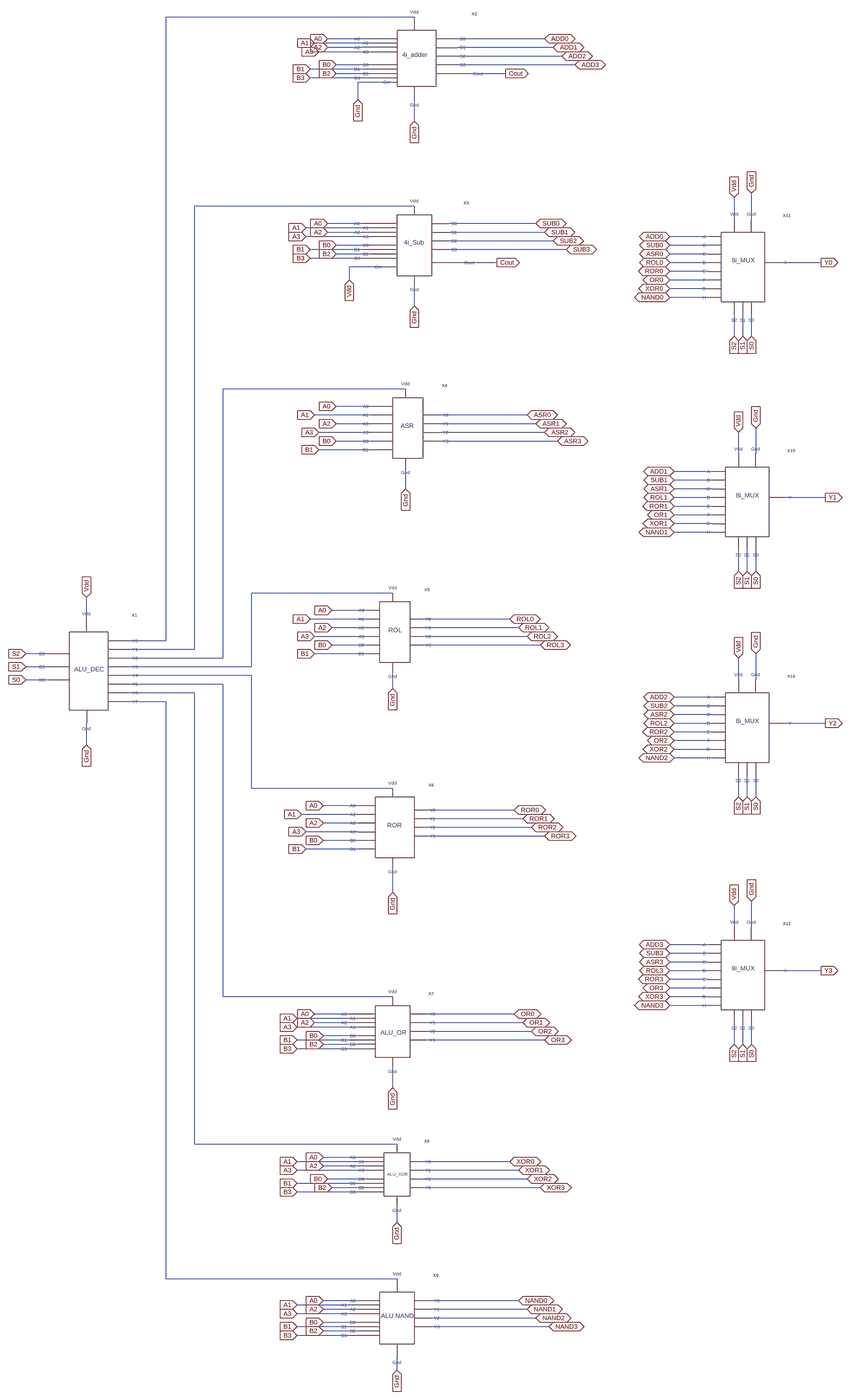
[diagram p0: schematic ALU.asc, whole sheet]
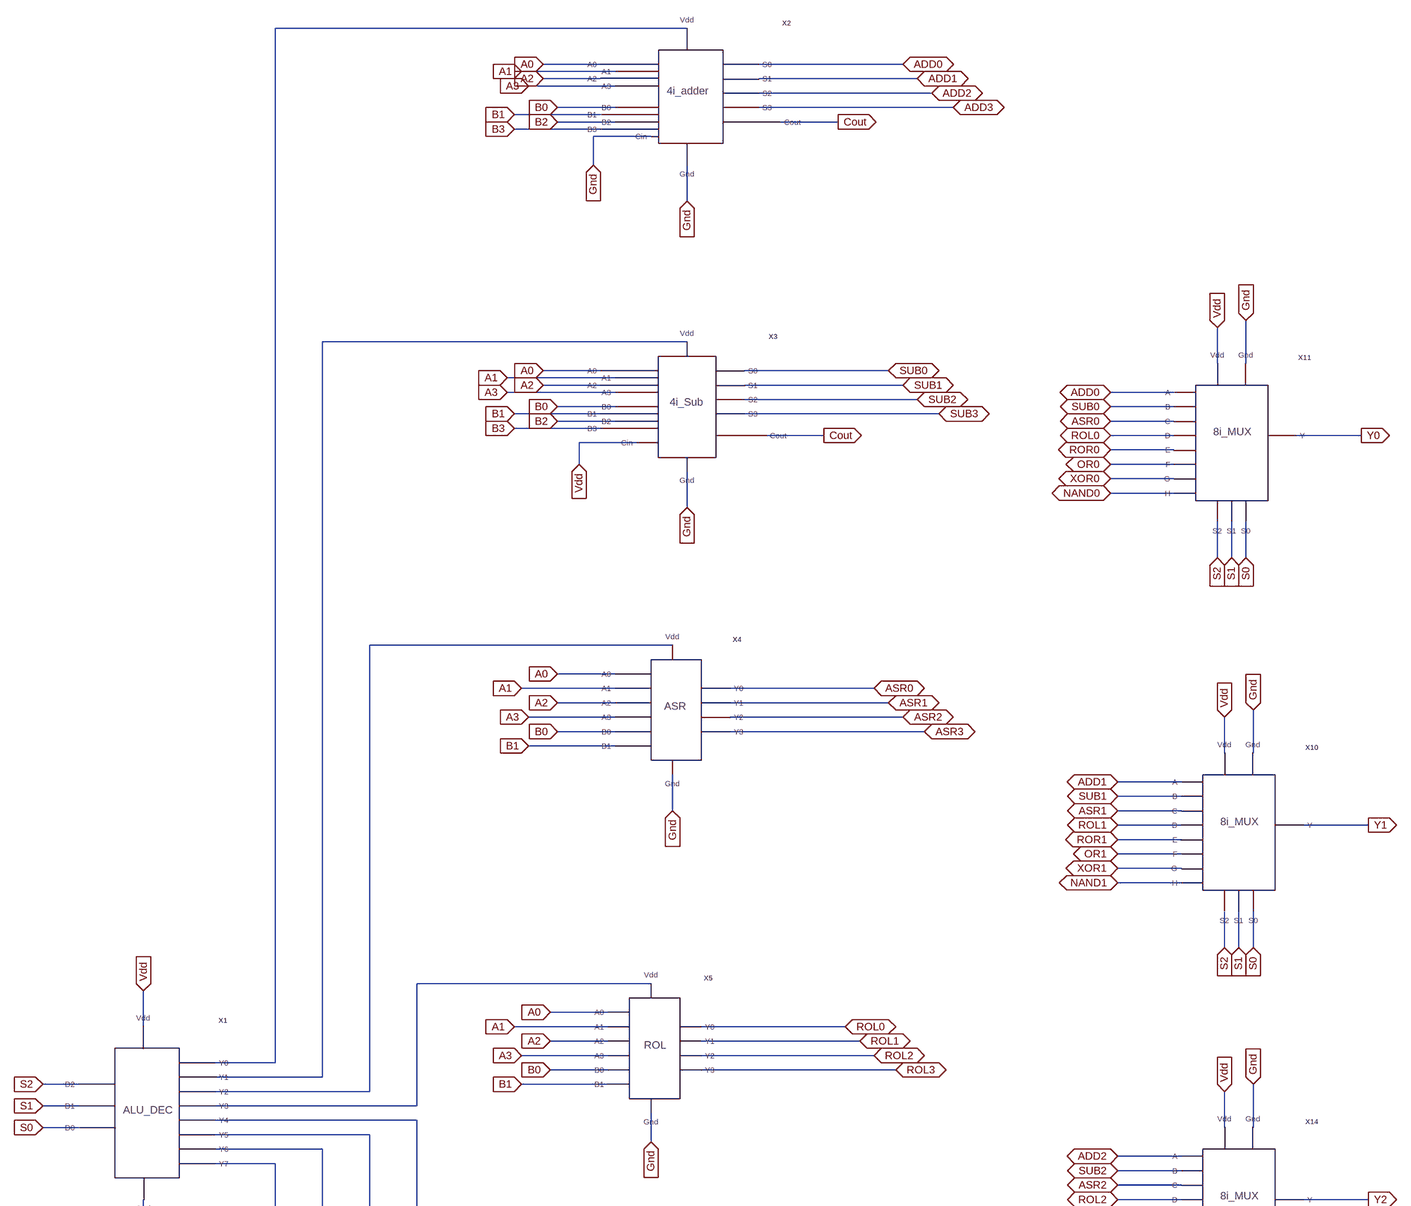
[diagram p1: schematic ALU.asc, part, row 1 of 2, column 1 of 1]
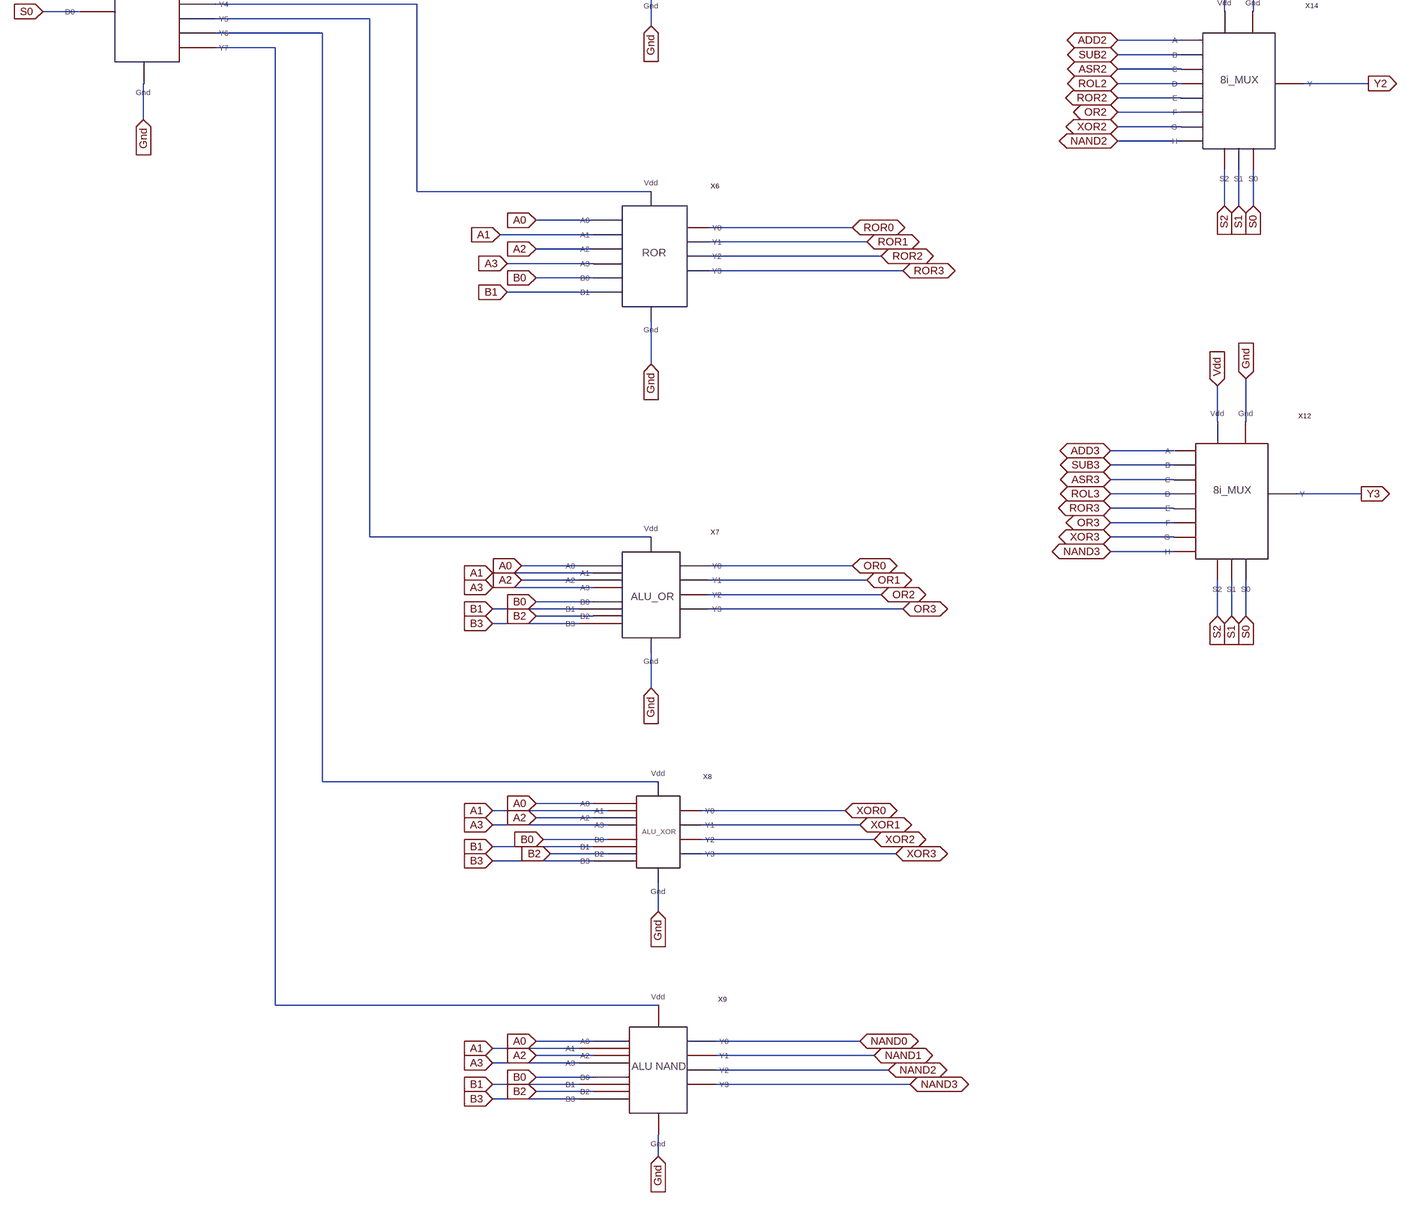
[diagram p2: schematic ALU.asc, part, row 2 of 2, column 1 of 1]
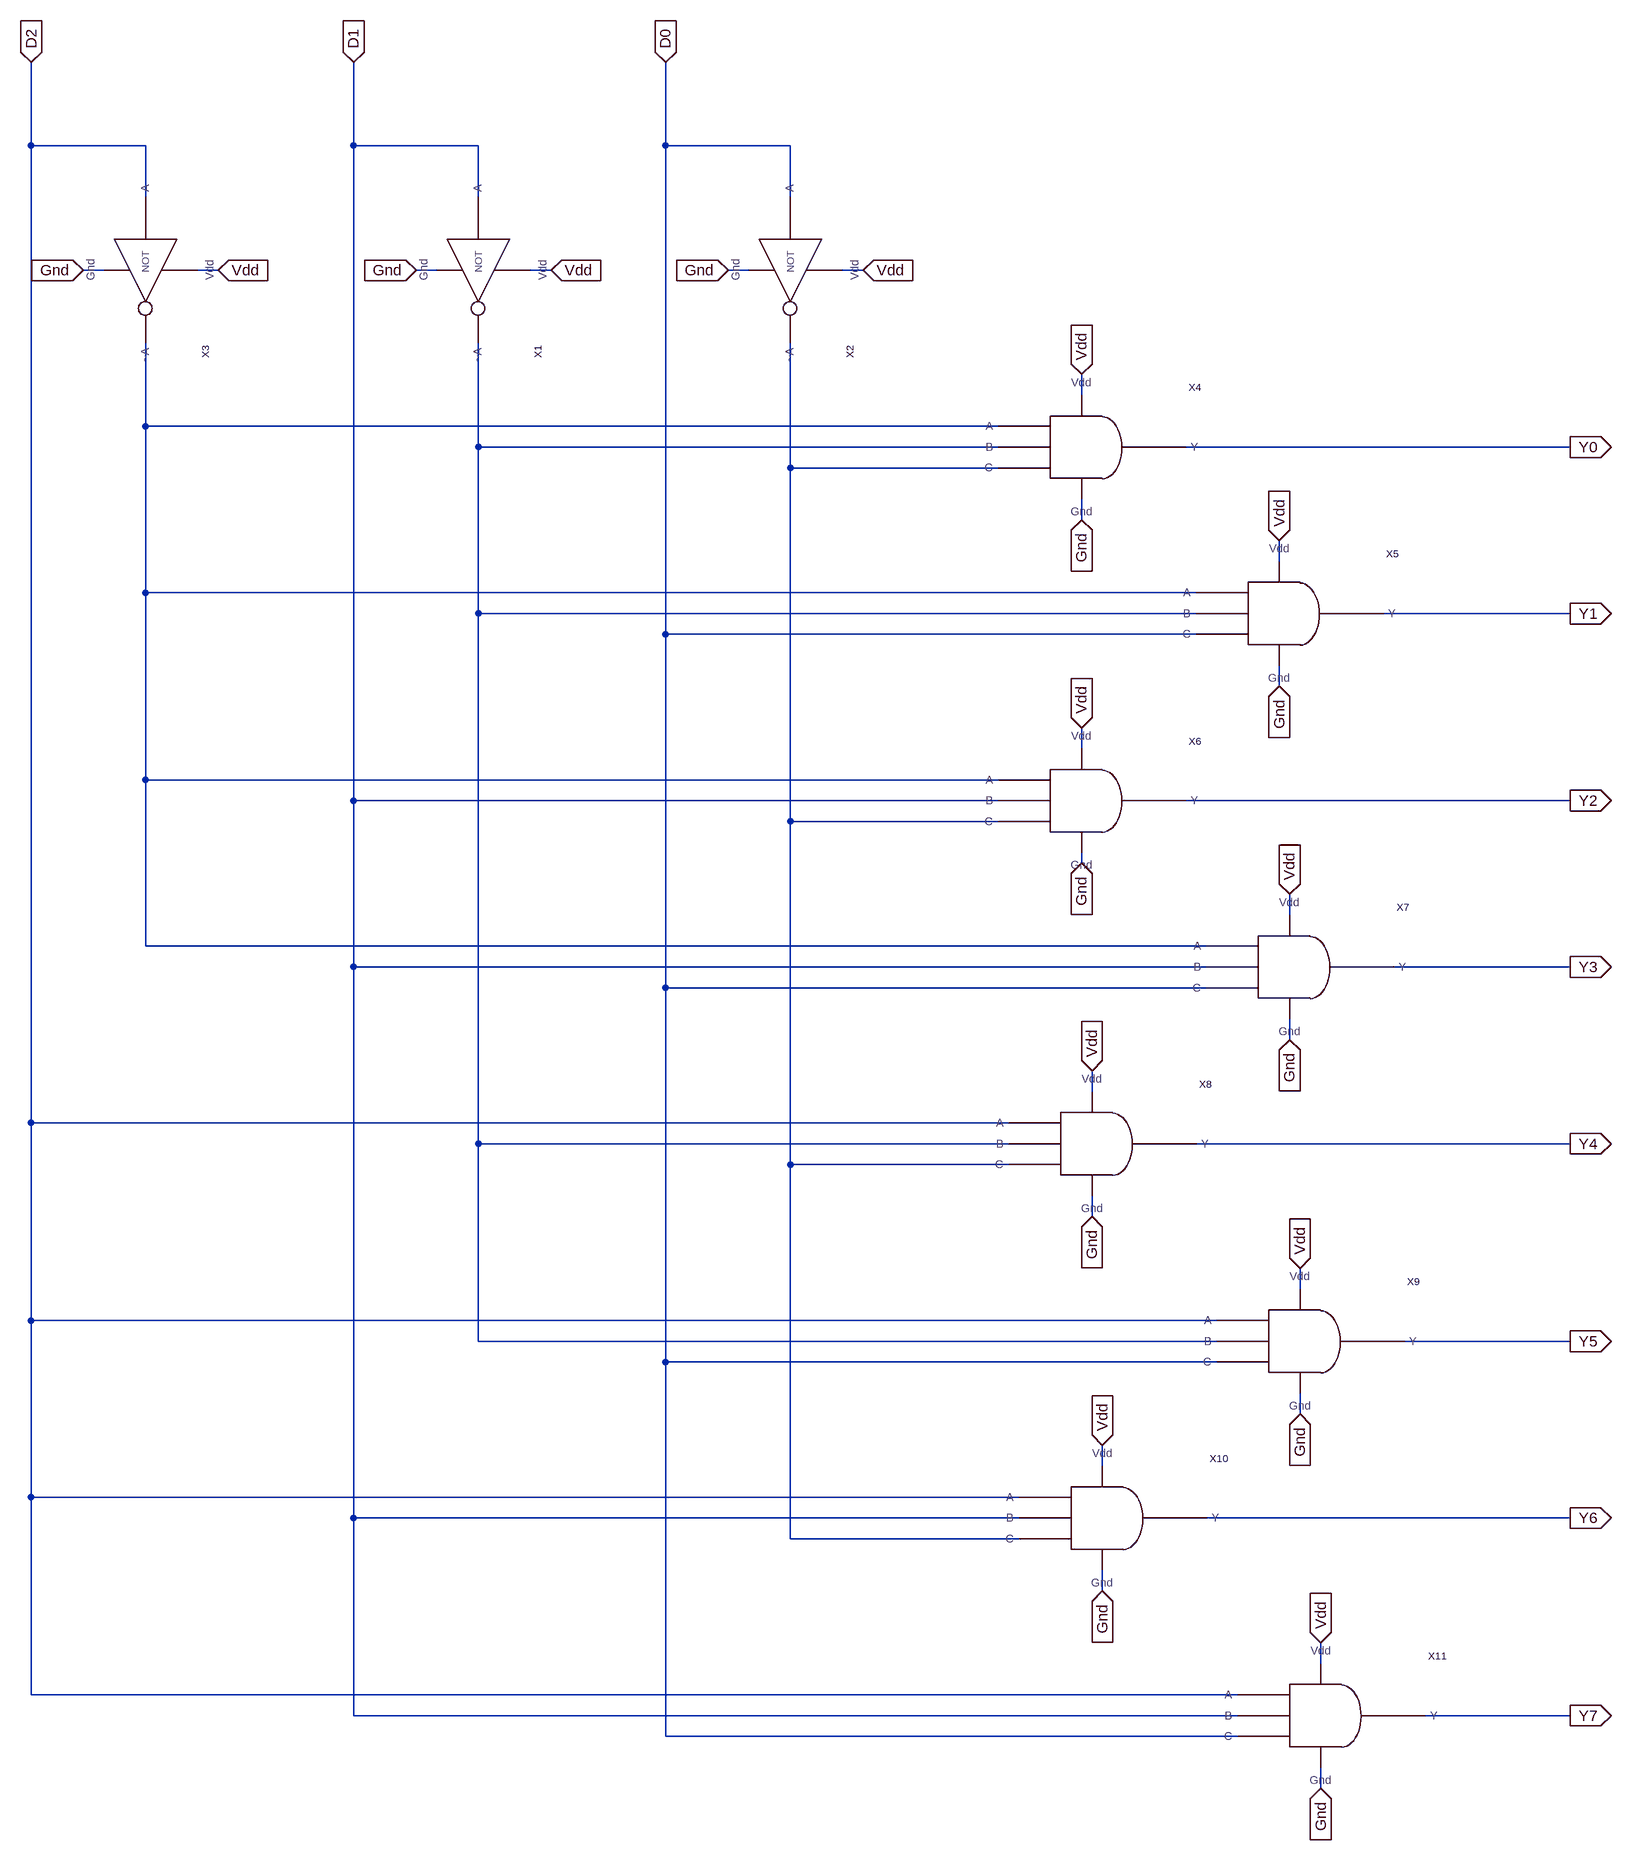
[diagram p3: sub-circuit alu_dec.asc]
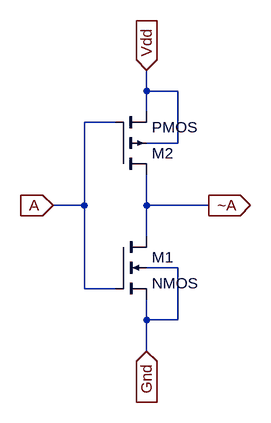
[diagram p4: sub-circuit not.asc]
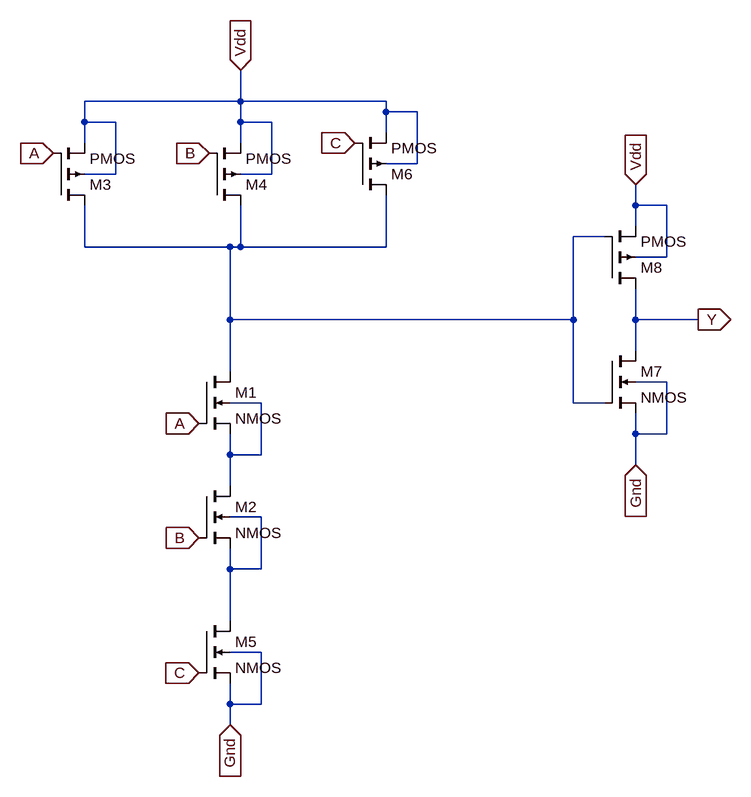
[diagram p5: sub-circuit 3iand.asc]
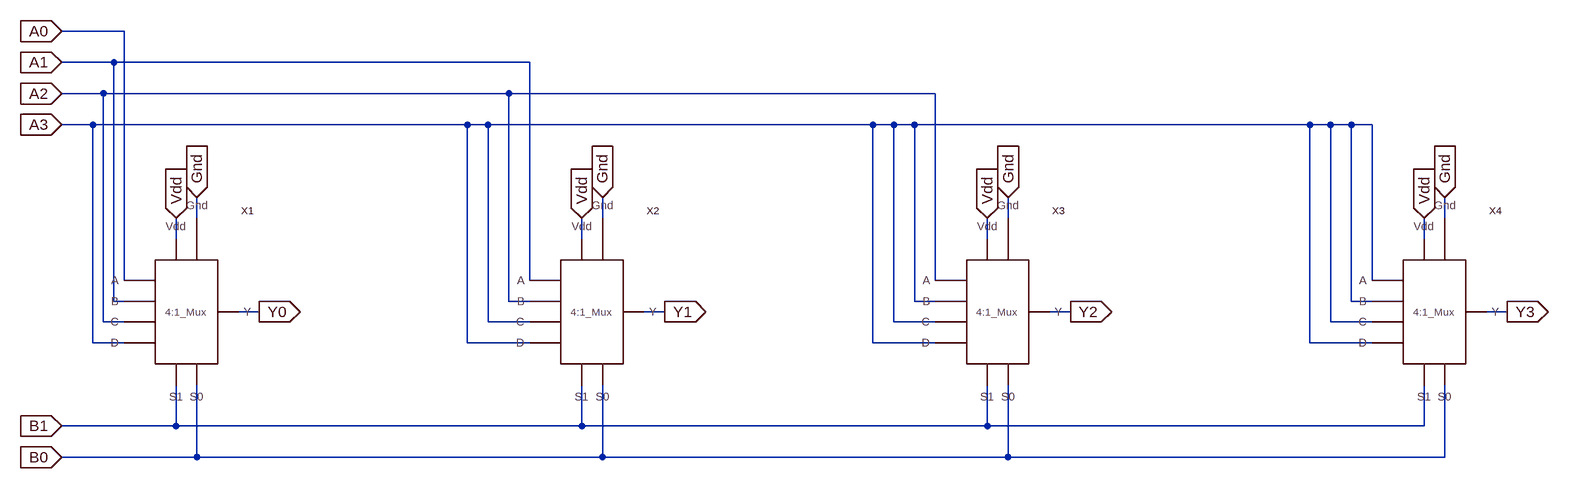
[diagram p6: sub-circuit alu_asr.asc]
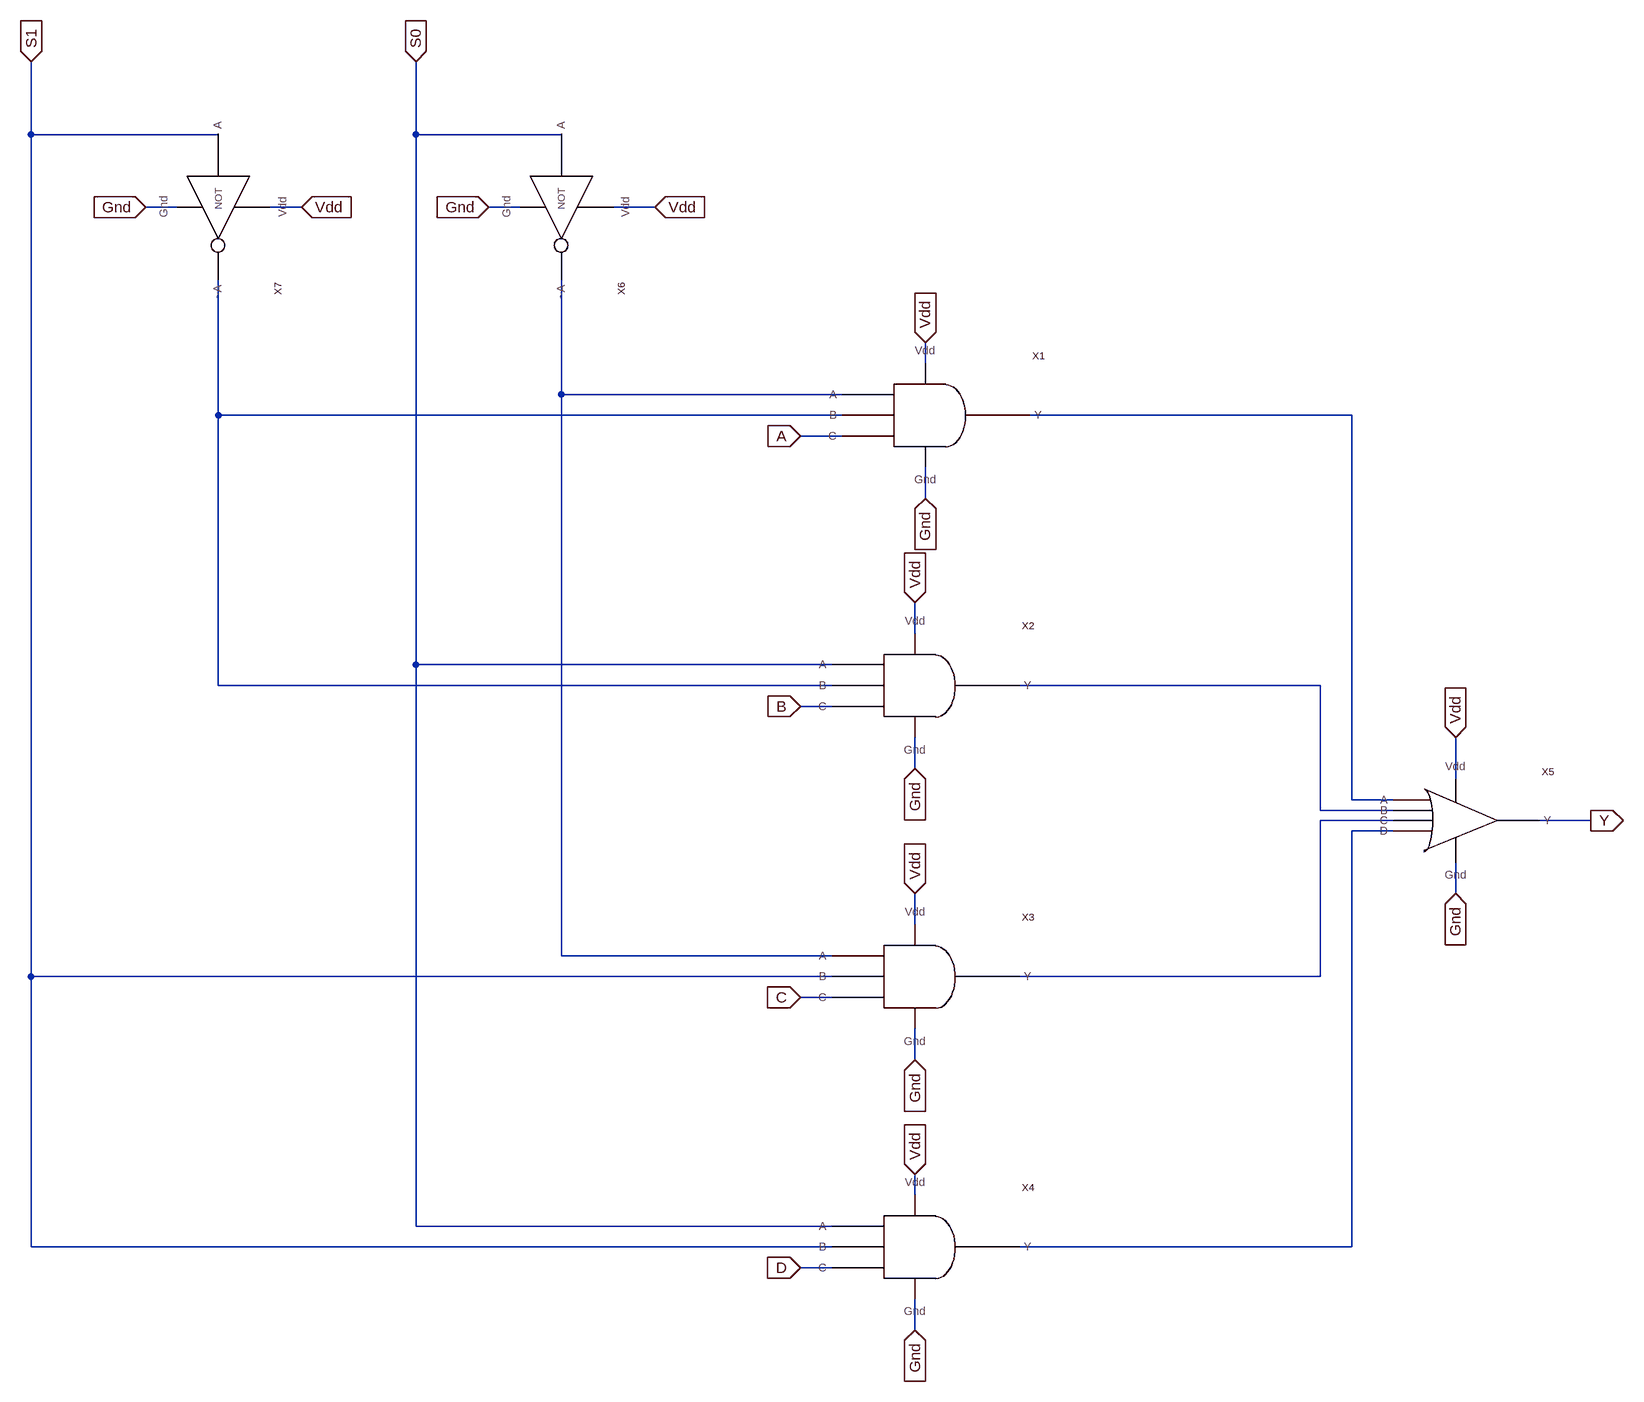
[diagram p7: sub-circuit 41_mux.asc]
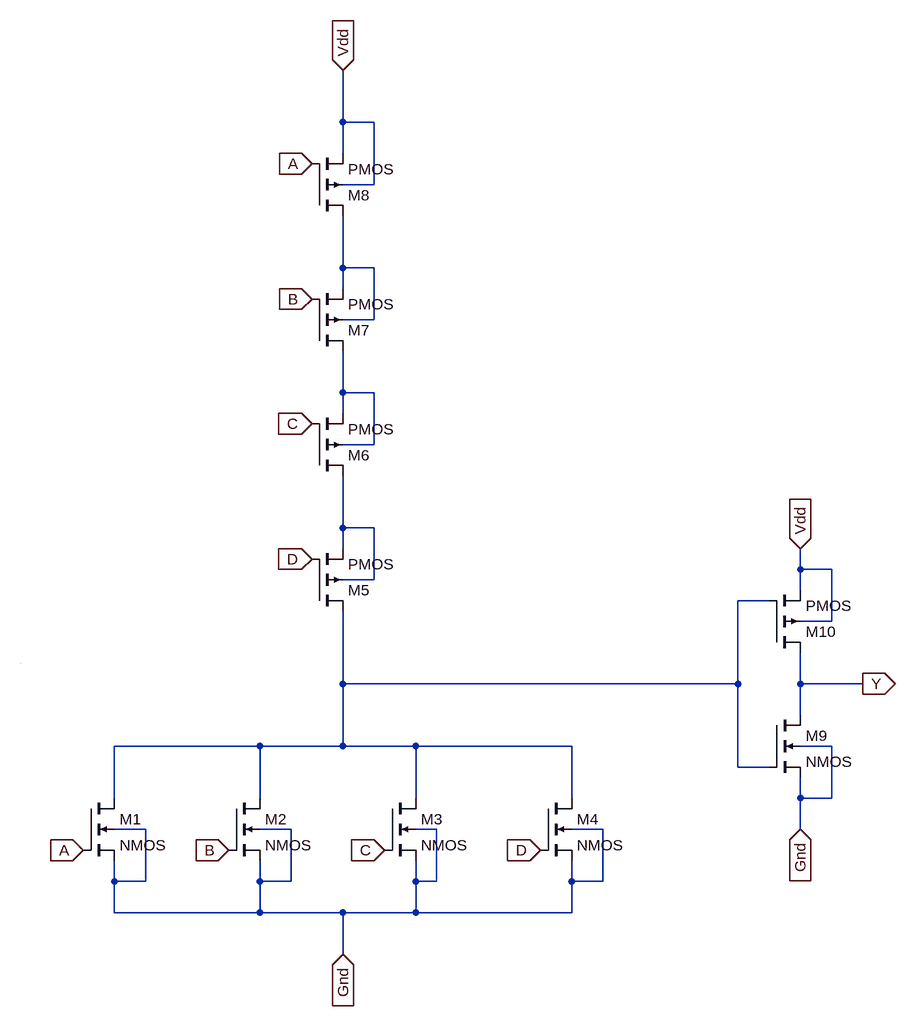
[diagram p8: sub-circuit 4i_or.asc]
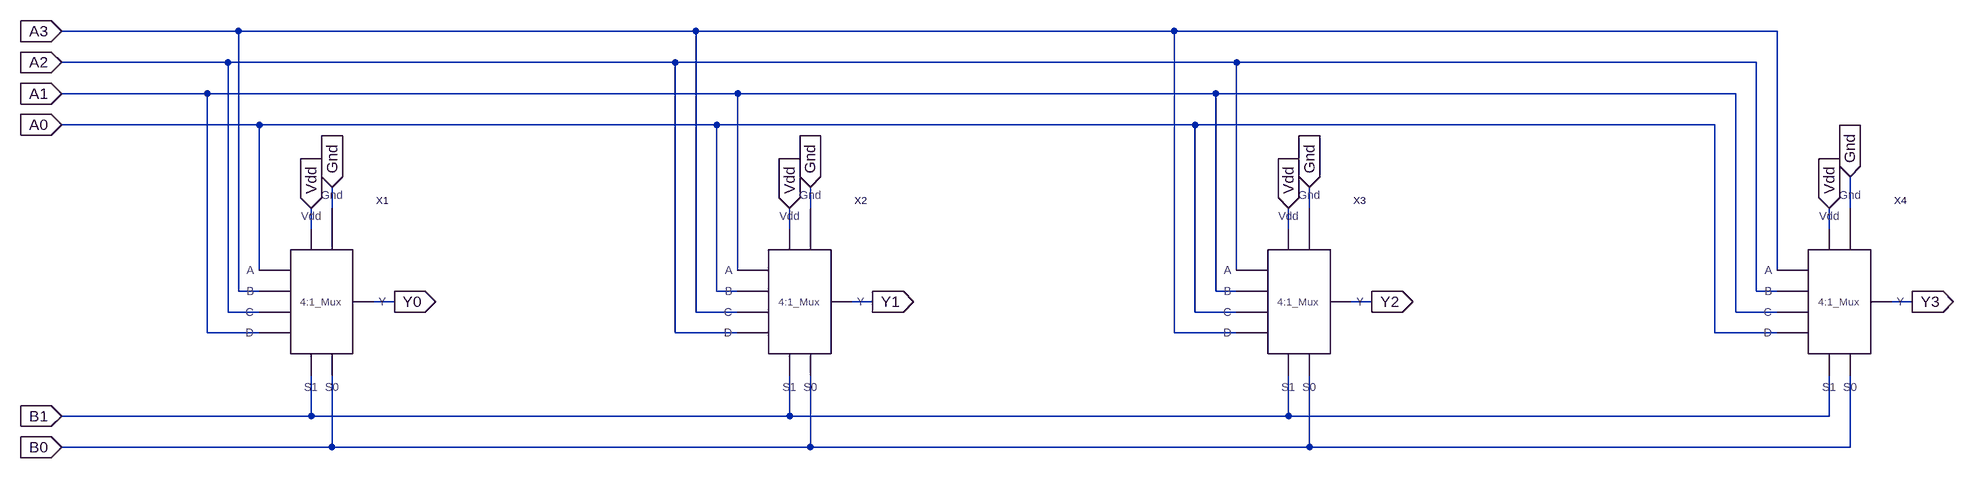
[diagram p9: sub-circuit alu_rol.asc]
ALU.asc, the LTspice schematic file:
Version 4
SHEET 1 3976 3496
WIRE 1664 -2304 288 -2304
WIRE 1472 -2224 1344 -2224
WIRE 2144 -2224 1824 -2224
WIRE 1504 -2208 1296 -2208
WIRE 1472 -2192 1344 -2192
WIRE 2176 -2192 1824 -2192
WIRE 1504 -2176 1312 -2176
WIRE 2208 -2160 1824 -2160
WIRE 1504 -2128 1376 -2128
WIRE 2256 -2128 1824 -2128
WIRE 1472 -2112 1280 -2112
WIRE 1504 -2096 1376 -2096
WIRE 2000 -2096 1872 -2096
WIRE 1472 -2080 1280 -2080
WIRE 1584 -2064 1456 -2064
WIRE 1456 -2000 1456 -2064
WIRE 1664 -1920 1664 -2000
WIRE 1664 -1552 432 -1552
WIRE 3328 -1504 3328 -1584
WIRE 3392 -1504 3392 -1600
WIRE 1472 -1488 1344 -1488
WIRE 2112 -1488 1792 -1488
WIRE 1504 -1472 1264 -1472
WIRE 1472 -1456 1344 -1456
WIRE 2144 -1456 1792 -1456
WIRE 1504 -1440 1264 -1440
WIRE 3232 -1440 3056 -1440
WIRE 2176 -1424 1792 -1424
WIRE 1504 -1408 1376 -1408
WIRE 3232 -1408 3056 -1408
WIRE 1472 -1392 1280 -1392
WIRE 2224 -1392 1792 -1392
WIRE 1504 -1376 1376 -1376
WIRE 3232 -1376 3056 -1376
WIRE 1472 -1360 1280 -1360
WIRE 1968 -1344 1840 -1344
WIRE 3232 -1344 3056 -1344
WIRE 3648 -1344 3504 -1344
WIRE 1552 -1328 1424 -1328
WIRE 3232 -1312 3056 -1312
WIRE 1424 -1280 1424 -1328
WIRE 3232 -1280 3056 -1280
WIRE 3232 -1248 3056 -1248
WIRE 3232 -1216 3056 -1216
WIRE 1664 -1184 1664 -1264
WIRE 3328 -1072 3328 -1152
WIRE 3360 -1072 3360 -1152
WIRE 3392 -1072 3392 -1152
WIRE 1632 -848 560 -848
WIRE 1504 -784 1376 -784
WIRE 1504 -752 1296 -752
WIRE 2080 -752 1760 -752
WIRE 1504 -720 1376 -720
WIRE 2112 -720 1760 -720
WIRE 1504 -688 1312 -688
WIRE 2144 -688 1760 -688
WIRE 1504 -656 1376 -656
WIRE 2192 -656 1760 -656
WIRE 1504 -624 1312 -624
WIRE 3344 -608 3344 -688
WIRE 3408 -608 3408 -704
WIRE 3248 -544 3072 -544
WIRE 3248 -512 3072 -512
WIRE 1632 -480 1632 -560
WIRE 3248 -480 3072 -480
WIRE 3248 -448 3072 -448
WIRE 3664 -448 3520 -448
WIRE 3248 -416 3072 -416
WIRE 3248 -384 3072 -384
WIRE 3248 -352 3072 -352
WIRE 3248 -320 3072 -320
WIRE 3344 -176 3344 -256
WIRE 3376 -176 3376 -256
WIRE 3408 -176 3408 -256
WIRE 1584 -96 688 -96
WIRE 1488 -32 1360 -32
WIRE -448 0 -448 -80
WIRE 1488 0 1280 0
WIRE 2016 0 1696 0
WIRE 1488 32 1360 32
WIRE 2048 32 1696 32
WIRE 1488 64 1296 64
WIRE 2080 64 1696 64
WIRE 288 80 288 -2304
WIRE 288 80 -288 80
WIRE 1488 96 1360 96
WIRE 2128 96 1696 96
WIRE 432 112 432 -1552
WIRE 432 112 -288 112
WIRE -592 128 -672 128
WIRE 1488 128 1296 128
WIRE 560 144 560 -848
WIRE 560 144 -288 144
WIRE -592 176 -672 176
WIRE 688 176 688 -96
WIRE 688 176 -288 176
WIRE 688 208 -288 208
WIRE -592 224 -672 224
WIRE 3344 224 3344 144
WIRE 3408 224 3408 128
WIRE 560 240 -288 240
WIRE 1584 256 1584 192
WIRE 432 272 -288 272
WIRE 3248 288 3072 288
WIRE 288 304 -288 304
WIRE 3248 320 3072 320
WIRE 3248 352 3072 352
WIRE 3248 384 3072 384
WIRE 3664 384 3520 384
WIRE 3248 416 3072 416
WIRE 3248 448 3072 448
WIRE -448 464 -448 384
WIRE 3248 480 3072 480
WIRE 3248 512 3072 512
WIRE 688 624 688 208
WIRE 1584 624 688 624
WIRE 3344 656 3344 576
WIRE 3376 656 3376 576
WIRE 3408 656 3408 576
WIRE 1456 688 1328 688
WIRE 2032 704 1712 704
WIRE 1456 720 1248 720
WIRE 2064 736 1712 736
WIRE 1456 752 1328 752
WIRE 2096 768 1712 768
WIRE 1456 784 1264 784
WIRE 2144 800 1712 800
WIRE 1456 816 1328 816
WIRE 1456 848 1264 848
WIRE 1584 1008 1584 912
WIRE 3328 1136 3328 1056
WIRE 3392 1136 3392 1040
WIRE 3232 1200 3056 1200
WIRE 3232 1232 3056 1232
WIRE 3232 1264 3056 1264
WIRE 3232 1296 3056 1296
WIRE 3648 1296 3504 1296
WIRE 3232 1328 3056 1328
WIRE 3232 1360 3056 1360
WIRE 560 1392 560 240
WIRE 1584 1392 560 1392
WIRE 3232 1392 3056 1392
WIRE 3232 1424 3056 1424
WIRE 1424 1456 1296 1456
WIRE 2032 1456 1712 1456
WIRE 1456 1472 1232 1472
WIRE 1424 1488 1296 1488
WIRE 2064 1488 1712 1488
WIRE 1456 1504 1232 1504
WIRE 2096 1520 1712 1520
WIRE 1456 1536 1328 1536
WIRE 1424 1552 1232 1552
WIRE 2144 1552 1712 1552
WIRE 1456 1568 1328 1568
WIRE 3328 1568 3328 1488
WIRE 3360 1568 3360 1488
WIRE 3392 1568 3392 1488
WIRE 1424 1584 1232 1584
WIRE 1584 1728 1584 1648
WIRE 432 2176 432 272
WIRE 1600 2176 432 2176
WIRE 1456 2224 1328 2224
WIRE 1488 2240 1232 2240
WIRE 2016 2240 1696 2240
WIRE 1456 2256 1328 2256
WIRE 1488 2272 1232 2272
WIRE 2048 2272 1696 2272
WIRE 1488 2304 1344 2304
WIRE 2080 2304 1696 2304
WIRE 1456 2320 1232 2320
WIRE 1488 2336 1360 2336
WIRE 2128 2336 1696 2336
WIRE 1456 2352 1232 2352
WIRE 1600 2464 1600 2400
WIRE 288 3056 288 304
WIRE 1600 3056 288 3056
WIRE 1456 3136 1328 3136
WIRE 2048 3136 1728 3136
WIRE 1424 3152 1232 3152
WIRE 1456 3168 1328 3168
WIRE 2080 3168 1728 3168
WIRE 1424 3184 1232 3184
WIRE 2112 3200 1728 3200
WIRE 1456 3216 1328 3216
WIRE 1424 3232 1232 3232
WIRE 2160 3232 1728 3232
WIRE 1456 3248 1328 3248
WIRE 1424 3264 1232 3264
WIRE 1600 3392 1600 3344
FLAG 1328 3136 A0
IOPIN 1328 3136 In
FLAG 1232 3152 A1
IOPIN 1232 3152 In
FLAG 1328 3168 A2
IOPIN 1328 3168 In
FLAG 1232 3184 A3
IOPIN 1232 3184 In
FLAG 1328 3216 B0
IOPIN 1328 3216 In
FLAG 1232 3232 B1
IOPIN 1232 3232 In
FLAG 1328 3248 B2
IOPIN 1328 3248 In
FLAG 1232 3264 B3
IOPIN 1232 3264 In
FLAG 1328 2224 A0
IOPIN 1328 2224 In
FLAG 1232 2240 A1
IOPIN 1232 2240 In
FLAG 1328 2256 A2
IOPIN 1328 2256 In
FLAG 1232 2272 A3
IOPIN 1232 2272 In
FLAG 1344 2304 B0
IOPIN 1344 2304 In
FLAG 1232 2320 B1
IOPIN 1232 2320 In
FLAG 1360 2336 B2
IOPIN 1360 2336 In
FLAG 1232 2352 B3
IOPIN 1232 2352 In
FLAG 1328 688 A0
IOPIN 1328 688 In
FLAG 1248 720 A1
IOPIN 1248 720 In
FLAG 1328 752 A2
IOPIN 1328 752 In
FLAG 1264 784 A3
IOPIN 1264 784 In
FLAG 1328 816 B0
IOPIN 1328 816 In
FLAG 1264 848 B1
IOPIN 1264 848 In
FLAG 1296 1456 A0
IOPIN 1296 1456 In
FLAG 1232 1472 A1
IOPIN 1232 1472 In
FLAG 1296 1488 A2
IOPIN 1296 1488 In
FLAG 1232 1504 A3
IOPIN 1232 1504 In
FLAG 1328 1536 B0
IOPIN 1328 1536 In
FLAG 1232 1552 B1
IOPIN 1232 1552 In
FLAG 1328 1568 B2
IOPIN 1328 1568 In
FLAG 1232 1584 B3
IOPIN 1232 1584 In
FLAG 1344 -2224 A0
IOPIN 1344 -2224 In
FLAG 1296 -2208 A1
IOPIN 1296 -2208 In
FLAG 1344 -2192 A2
IOPIN 1344 -2192 In
FLAG 1312 -2176 A3
IOPIN 1312 -2176 In
FLAG 1376 -2128 B0
IOPIN 1376 -2128 In
FLAG 1280 -2112 B1
IOPIN 1280 -2112 In
FLAG 1360 -32 A0
IOPIN 1360 -32 In
FLAG 1280 0 A1
IOPIN 1280 0 In
FLAG 1360 32 A2
IOPIN 1360 32 In
FLAG 1296 64 A3
IOPIN 1296 64 In
FLAG 1360 96 B0
IOPIN 1360 96 In
FLAG 1296 128 B1
IOPIN 1296 128 In
FLAG 1376 -2096 B2
IOPIN 1376 -2096 In
FLAG 1280 -2080 B3
IOPIN 1280 -2080 In
FLAG 1376 -784 A0
IOPIN 1376 -784 In
FLAG 1296 -752 A1
IOPIN 1296 -752 In
FLAG 1376 -720 A2
IOPIN 1376 -720 In
FLAG 1312 -688 A3
IOPIN 1312 -688 In
FLAG 1376 -656 B0
IOPIN 1376 -656 In
FLAG 1312 -624 B1
IOPIN 1312 -624 In
FLAG 1344 -1488 A0
IOPIN 1344 -1488 In
FLAG 1264 -1472 A1
IOPIN 1264 -1472 In
FLAG 1344 -1456 A2
IOPIN 1344 -1456 In
FLAG 1264 -1440 A3
IOPIN 1264 -1440 In
FLAG 1376 -1408 B0
IOPIN 1376 -1408 In
FLAG 1280 -1392 B1
IOPIN 1280 -1392 In
FLAG 1376 -1376 B2
IOPIN 1376 -1376 In
FLAG 1280 -1360 B3
IOPIN 1280 -1360 In
FLAG 1424 -1280 Vdd
IOPIN 1424 -1280 In
FLAG 2144 -2224 ADD0
IOPIN 2144 -2224 BiDir
FLAG 2176 -2192 ADD1
IOPIN 2176 -2192 BiDir
FLAG 2208 -2160 ADD2
IOPIN 2208 -2160 BiDir
FLAG 2256 -2128 ADD3
IOPIN 2256 -2128 BiDir
FLAG 2000 -2096 Cout
IOPIN 2000 -2096 Out
FLAG 3056 -1440 ADD0
IOPIN 3056 -1440 BiDir
FLAG 2112 -1488 SUB0
IOPIN 2112 -1488 BiDir
FLAG 2144 -1456 SUB1
IOPIN 2144 -1456 BiDir
FLAG 2176 -1424 SUB2
IOPIN 2176 -1424 BiDir
FLAG 2224 -1392 SUB3
IOPIN 2224 -1392 BiDir
FLAG 1968 -1344 Cout
IOPIN 1968 -1344 Out
FLAG 3056 -1408 SUB0
IOPIN 3056 -1408 BiDir
FLAG 2080 -752 ASR0
IOPIN 2080 -752 BiDir
FLAG 2112 -720 ASR1
IOPIN 2112 -720 BiDir
FLAG 2144 -688 ASR2
IOPIN 2144 -688 BiDir
FLAG 2192 -656 ASR3
IOPIN 2192 -656 BiDir
FLAG 2016 0 ROL0
IOPIN 2016 0 BiDir
FLAG 2048 32 ROL1
IOPIN 2048 32 BiDir
FLAG 2080 64 ROL2
IOPIN 2080 64 BiDir
FLAG 2128 96 ROL3
IOPIN 2128 96 BiDir
FLAG 2032 704 ROR0
IOPIN 2032 704 BiDir
FLAG 2064 736 ROR1
IOPIN 2064 736 BiDir
FLAG 2096 768 ROR2
IOPIN 2096 768 BiDir
FLAG 2144 800 ROR3
IOPIN 2144 800 BiDir
FLAG 2032 1456 OR0
IOPIN 2032 1456 BiDir
FLAG 2064 1488 OR1
IOPIN 2064 1488 BiDir
FLAG 2096 1520 OR2
IOPIN 2096 1520 BiDir
FLAG 2144 1552 OR3
IOPIN 2144 1552 BiDir
FLAG 2016 2240 XOR0
IOPIN 2016 2240 BiDir
FLAG 2048 2272 XOR1
IOPIN 2048 2272 BiDir
FLAG 2080 2304 XOR2
IOPIN 2080 2304 BiDir
FLAG 2128 2336 XOR3
IOPIN 2128 2336 BiDir
FLAG 2048 3136 NAND0
IOPIN 2048 3136 BiDir
FLAG 2080 3168 NAND1
IOPIN 2080 3168 BiDir
FLAG 2112 3200 NAND2
IOPIN 2112 3200 BiDir
FLAG 2160 3232 NAND3
IOPIN 2160 3232 BiDir
FLAG 3392 -1072 S0
IOPIN 3392 -1072 In
FLAG 3360 -1072 S1
IOPIN 3360 -1072 In
FLAG 3328 -1072 S2
IOPIN 3328 -1072 In
FLAG 3056 -1376 ASR0
IOPIN 3056 -1376 BiDir
FLAG 3056 -1344 ROL0
IOPIN 3056 -1344 BiDir
FLAG 3056 -1312 ROR0
IOPIN 3056 -1312 BiDir
FLAG 3056 -1248 XOR0
IOPIN 3056 -1248 BiDir
FLAG 3056 -1216 NAND0
IOPIN 3056 -1216 BiDir
FLAG 3648 -1344 Y0
IOPIN 3648 -1344 Out
FLAG 3328 -1584 Vdd
IOPIN 3328 -1584 In
FLAG 3072 -544 ADD1
IOPIN 3072 -544 BiDir
FLAG 3072 -512 SUB1
IOPIN 3072 -512 BiDir
FLAG 3408 -176 S0
IOPIN 3408 -176 In
FLAG 3376 -176 S1
IOPIN 3376 -176 In
FLAG 3344 -176 S2
IOPIN 3344 -176 In
FLAG 3072 -480 ASR1
IOPIN 3072 -480 BiDir
FLAG 3072 -448 ROL1
IOPIN 3072 -448 BiDir
FLAG 3072 -416 ROR1
IOPIN 3072 -416 BiDir
FLAG 3072 -352 XOR1
IOPIN 3072 -352 BiDir
FLAG 3072 -320 NAND1
IOPIN 3072 -320 BiDir
FLAG 3664 -448 Y1
IOPIN 3664 -448 Out
FLAG 3344 -688 Vdd
IOPIN 3344 -688 In
FLAG 3072 288 ADD2
IOPIN 3072 288 BiDir
FLAG 3072 320 SUB2
IOPIN 3072 320 BiDir
FLAG 3408 656 S0
IOPIN 3408 656 In
FLAG 3376 656 S1
IOPIN 3376 656 In
FLAG 3344 656 S2
IOPIN 3344 656 In
FLAG 3072 352 ASR2
IOPIN 3072 352 BiDir
FLAG 3072 384 ROL2
IOPIN 3072 384 BiDir
FLAG 3072 416 ROR2
IOPIN 3072 416 BiDir
FLAG 3072 480 XOR2
IOPIN 3072 480 BiDir
FLAG 3072 512 NAND2
IOPIN 3072 512 BiDir
FLAG 3664 384 Y2
IOPIN 3664 384 Out
FLAG 3344 144 Vdd
IOPIN 3344 144 In
FLAG 3056 1200 ADD3
IOPIN 3056 1200 BiDir
FLAG 3056 1232 SUB3
IOPIN 3056 1232 BiDir
FLAG 3392 1568 S0
IOPIN 3392 1568 In
FLAG 3360 1568 S1
IOPIN 3360 1568 In
FLAG 3328 1568 S2
IOPIN 3328 1568 In
FLAG 3056 1264 ASR3
IOPIN 3056 1264 BiDir
FLAG 3056 1296 ROL3
IOPIN 3056 1296 BiDir
FLAG 3056 1328 ROR3
IOPIN 3056 1328 BiDir
FLAG 3056 1392 XOR3
IOPIN 3056 1392 BiDir
FLAG 3056 1424 NAND3
IOPIN 3056 1424 BiDir
FLAG 3648 1296 Y3
IOPIN 3648 1296 Out
FLAG 3328 1056 Vdd
IOPIN 3328 1056 In
FLAG -448 -80 Vdd
IOPIN -448 -80 In
FLAG -672 128 S2
IOPIN -672 128 In
FLAG -672 176 S1
IOPIN -672 176 In
FLAG -672 224 S0
IOPIN -672 224 In
FLAG 3056 1360 OR3
IOPIN 3056 1360 BiDir
FLAG 3056 -1280 OR0
IOPIN 3056 -1280 BiDir
FLAG 3072 -384 OR1
IOPIN 3072 -384 BiDir
FLAG 3072 448 OR2
IOPIN 3072 448 BiDir
FLAG -448 464 Gnd
IOPIN -448 464 In
FLAG 1664 -1920 Gnd
IOPIN 1664 -1920 In
FLAG 1456 -2000 Gnd
IOPIN 1456 -2000 In
FLAG 1664 -1184 Gnd
IOPIN 1664 -1184 In
FLAG 1632 -480 Gnd
IOPIN 1632 -480 In
FLAG 1584 256 Gnd
IOPIN 1584 256 In
FLAG 1584 1008 Gnd
IOPIN 1584 1008 In
FLAG 1584 1728 Gnd
IOPIN 1584 1728 In
FLAG 1600 2464 Gnd
IOPIN 1600 2464 In
FLAG 1600 3392 Gnd
IOPIN 1600 3392 In
FLAG 3392 1040 Gnd
IOPIN 3392 1040 In
FLAG 3408 128 Gnd
IOPIN 3408 128 In
FLAG 3408 -704 Gnd
IOPIN 3408 -704 In
FLAG 3392 -1600 Gnd
IOPIN 3392 -1600 In
SYMBOL ALU_DEC -432 112 R0
SYMATTR InstName X1
SYMBOL ALU_ADD 1664 -2160 R0
SYMATTR InstName X2
SYMBOL ALU_SUB 1664 -1456 R0
SYMATTR InstName X3
SYMBOL ALU_ASR 1648 -752 R0
SYMATTR InstName X4
SYMBOL ALU_ROL 1616 0 R0
SYMATTR InstName X5
SYMBOL ALU_ROR 1584 720 R0
SYMATTR InstName X6
SYMBOL ALU_OR 1600 1488 R0
SYMATTR InstName X7
SYMBOL ALU_XOR 1616 2272 R0
SYMATTR InstName X8
SYMBOL ALU_NAND 1616 3168 R0
SYMATTR InstName X9
SYMBOL ALU_MUX 3360 -1376 R0
SYMATTR InstName X11
SYMBOL ALU_MUX 3376 -480 R0
SYMATTR InstName X10
SYMBOL ALU_MUX 3376 352 R0
SYMATTR InstName X14
SYMBOL ALU_MUX 3360 1264 R0
SYMATTR InstName X12

The netlist it stands for:
* ALU.asc
XX1 S0 S1 S2 Vdd Gnd N001 N002 N003 N004 N005 N006 N007 N008 alu_dec
XX2 A0 A1 A2 A3 B0 B1 B2 B3 Gnd N001 ADD0 ADD1 ADD2 ADD3 Cout Gnd ALU_ADD  ; pins A0 A1 A2 A3 B0 B1 B2 B3 Gnd Vdd S0 S1 S2 S3 Cout Cin
XX3 A0 A1 A2 A3 B0 B1 B2 B3 Vdd N002 Gnd SUB0 SUB1 SUB2 SUB3 Cout ALU_SUB  ; pins A0 A1 A2 A3 B0 B1 B2 B3 Cin Vdd Gnd S0 S1 S2 S3 Cout
XX4 A0 A1 A2 A3 B0 B1 N003 Gnd ASR0 ASR1 ASR2 ASR3 alu_asr
XX5 A0 A1 A2 A3 B0 B1 N004 Gnd ROL0 ROL1 ROL2 ROL3 alu_rol
XX6 A0 A1 A2 A3 B0 B1 Gnd N005 ROR0 ROR1 ROR2 ROR3 alu_ror
XX7 A0 A1 A2 A3 B0 B1 B2 B3 N006 Gnd OR0 OR1 OR2 OR3 alu_or
XX8 A0 A1 A2 A3 B0 B1 B2 B3 N007 Gnd XOR0 XOR1 XOR2 XOR3 alu_xor
XX9 A0 A1 A2 A3 B0 B1 B2 B3 NAND0 NAND1 NAND2 NAND3 N008 Gnd alu_nand
XX11 ADD0 SUB0 ASR0 ROL0 ROR0 OR0 XOR0 NAND0 S0 S1 S2 Y0 Vdd Gnd alu_mux
XX10 ADD1 SUB1 ASR1 ROL1 ROR1 OR1 XOR1 NAND1 S0 S1 S2 Y1 Vdd Gnd alu_mux
XX14 ADD2 SUB2 ASR2 ROL2 ROR2 OR2 XOR2 NAND2 S0 S1 S2 Y2 Vdd Gnd alu_mux
XX12 ADD3 SUB3 ASR3 ROL3 ROR3 OR3 XOR3 NAND3 S0 S1 S2 Y3 Vdd Gnd alu_mux

* block symbol definitions
.subckt alu_dec D0 D1 D2 Vdd Gnd Y0 Y1 Y2 Y3 Y4 Y5 Y6 Y7
XX1 D1 N002 Vdd Gnd not
XX2 D0 N003 Vdd Gnd not
XX3 D2 N001 Vdd Gnd not
XX4 N001 N002 N003 Vdd Gnd Y0 3iand
XX5 N001 N002 D0 Vdd Gnd Y1 3iand
XX6 N001 D1 N003 Vdd Gnd Y2 3iand
XX7 N001 D1 D0 Vdd Gnd Y3 3iand
XX8 D2 N002 N003 Vdd Gnd Y4 3iand
XX9 D2 N002 D0 Vdd Gnd Y5 3iand
XX10 D2 D1 N003 Vdd Gnd Y6 3iand
XX11 D2 D1 D0 Vdd Gnd Y7 3iand
.ends alu_dec

.subckt not A ~A Vdd Gnd
M1 ~A A Gnd Gnd NMOS
M2 ~A A Vdd Vdd PMOS
.ends not

.subckt 3iand A B C Vdd Gnd Y
M1 N001 A N002 N002 NMOS
M2 N002 B N003 N003 NMOS
M3 N001 A Vdd Vdd PMOS
M4 N001 B Vdd Vdd PMOS
M5 N003 C Gnd Gnd NMOS
M6 N001 C Vdd Vdd PMOS
M7 Y N001 Gnd Gnd NMOS
M8 Y N001 Vdd Vdd PMOS
.ends 3iand

.subckt alu_asr A0 A1 A2 A3 B0 B1 Vdd Gnd Y0 Y1 Y2 Y3
XX1 A0 A1 A2 A3 B0 B1 Y0 Vdd Gnd 41_mux
XX2 A1 A2 A3 A3 B0 B1 Y1 Vdd Gnd 41_mux
XX3 A2 A3 A3 A3 B0 B1 Y2 Vdd Gnd 41_mux
XX4 A3 A3 A3 A3 B0 B1 Y3 Vdd Gnd 41_mux
.ends alu_asr

.subckt 41_mux A B C D S0 S1 Y Vdd Gnd
XX1 N001 N002 A Vdd Gnd N003 3iand
XX2 S0 N002 B Vdd Gnd N004 3iand
XX3 N001 S1 C Vdd Gnd N005 3iand
XX4 S0 S1 D Vdd Gnd N006 3iand
XX5 N003 N004 N005 N006 Vdd Gnd Y 4i_or
XX6 S0 N001 Vdd Gnd not
XX7 S1 N002 Vdd Gnd not
.ends 41_mux

.subckt 4i_or A B C D Vdd Gnd Y
M1 N004 A Gnd Gnd NMOS
M2 N004 B Gnd Gnd NMOS
M3 N004 C Gnd Gnd NMOS
M4 N004 D Gnd Gnd NMOS
M5 N004 D N003 N003 PMOS
M6 N003 C N002 N002 PMOS
M7 N002 B N001 N001 PMOS
M8 N001 A Vdd Vdd PMOS
M9 Y N004 Gnd Gnd NMOS
M10 Y N004 Vdd Vdd PMOS
.ends 4i_or

.subckt alu_rol A0 A1 A2 A3 B0 B1 Vdd Gnd Y0 Y1 Y2 Y3
XX1 A0 A3 A2 A1 B0 B1 Y0 Vdd Gnd 41_mux
XX2 A1 A0 A3 A2 B0 B1 Y1 Vdd Gnd 41_mux
XX3 A2 A1 A0 A3 B0 B1 Y2 Vdd Gnd 41_mux
XX4 A3 A2 A1 A0 B0 B1 Y3 Vdd Gnd 41_mux
.ends alu_rol

.subckt alu_ror A0 A1 A2 A3 B0 B1 Gnd Vdd Y0 Y1 Y2 Y3
XX1 A0 A1 A2 A3 B0 B1 Y0 Vdd Gnd 41_mux
XX2 A1 A2 A3 A0 B0 B1 Y1 Vdd Gnd 41_mux
XX3 A2 A3 A0 A1 B0 B1 Y2 Vdd Gnd 41_mux
XX4 A3 A0 A1 A2 B0 B1 Y3 Vdd Gnd 41_mux
.ends alu_ror

.subckt alu_or A0 A1 A2 A3 B0 B1 B2 B3 Vdd Gnd Y0 Y1 Y2 Y3
XX1 Vdd Y1 Gnd A1 B1 or
XX2 Vdd Y0 Gnd A0 B0 or
XX3 Vdd Y2 Gnd A2 B2 or
XX4 Vdd Y3 Gnd A3 B3 or
.ends alu_or

.subckt or Vdd Y Gnd A B
M1 N002 A Gnd Gnd NMOS
M2 N002 B Gnd Gnd NMOS
M3 N001 A Vdd Vdd PMOS
M4 N002 B N001 N001 PMOS
M5 Y N002 Gnd Gnd NMOS
M6 Y N002 Vdd Vdd PMOS
.ends or

.subckt alu_xor A0 A1 A2 A3 B0 B1 B2 B3 Vdd Gnd Y0 Y1 Y2 Y3
XX1 Vdd Gnd A0 B0 Y0 XOR1  ; pins Vdd Gnd A B Y
XX2 Vdd Gnd A1 B1 Y1 XOR1  ; pins Vdd Gnd A B Y
XX3 Vdd Gnd A2 B2 Y2 XOR1  ; pins Vdd Gnd A B Y
XX4 Vdd Gnd A3 B3 Y3 XOR1  ; pins Vdd Gnd A B Y
.ends alu_xor

.subckt alu_nand A0 A1 A2 A3 B0 B1 B2 B3 Y0 Y1 Y2 Y3 Vdd Gnd
XX1 A0 B0 Vdd Gnd Y0 nand
XX2 A1 B1 Vdd Gnd Y1 nand
XX3 A2 B2 Vdd Gnd Y2 nand
XX4 A3 B3 Vdd Gnd Y3 nand
.ends alu_nand

.subckt nand A B Vdd Gnd Y
M1 Y A N001 N001 NMOS
M2 N001 B Gnd Gnd NMOS
M3 Y A Vdd Vdd PMOS
M4 Y B Vdd Vdd PMOS
.ends nand

.subckt alu_mux A B C D E F G H S0 S1 S2 Y Vdd Gnd
XX1 B N001 N003 S0 Vdd Gnd N005 4iand
XX2 C N001 S1 N004 Vdd Gnd N006 4iand
XX3 D N001 S1 S0 Vdd Gnd N007 4iand
XX4 E N003 S2 N004 Vdd Gnd N008 4iand
XX5 F S2 N003 S0 Vdd Gnd N009 4iand
XX6 G S2 S1 N004 Vdd Gnd N010 4iand
XX7 H S2 S1 S0 Vdd Gnd N011 4iand
XX8 A N001 N003 N004 Vdd Gnd N002 4iand
XX9 S0 N004 Vdd Gnd not
XX10 S1 N003 Vdd Gnd not
XX11 S2 N001 Vdd Gnd not
XX12 N002 N005 N006 N007 N008 N009 N010 N011 Vdd Gnd Y 8i_or
.ends alu_mux

.subckt 4iand A B C D Vdd Gnd Y
M1 N001 A N002 N002 NMOS
M2 N002 B N003 N003 NMOS
M3 N001 A Vdd Vdd PMOS
M4 N001 B Vdd Vdd PMOS
M5 N003 C N004 N004 NMOS
M6 N001 C Vdd Vdd PMOS
M7 Y N001 Gnd Gnd NMOS
M8 Y N001 Vdd Vdd PMOS
M9 N004 D Gnd Gnd NMOS
M10 N001 D Vdd Vdd PMOS
.ends 4iand

.subckt 8i_or A B C D E F G H Vdd Gnd Y
M1 N008 E Gnd Gnd NMOS
M2 N008 F Gnd Gnd NMOS
M3 N008 G Gnd Gnd NMOS
M4 N008 H Gnd Gnd NMOS
M5 N008 H N007 N007 PMOS
M6 N007 G N006 N006 PMOS
M7 N006 F N005 N005 PMOS
M8 N005 E N004 N004 PMOS
M9 Y N008 Gnd Gnd NMOS
M10 Y N008 Vdd Vdd PMOS
M11 N004 D N003 N003 PMOS
M12 N003 C N002 N002 PMOS
M13 N002 B N001 N001 PMOS
M14 N001 A Vdd Vdd PMOS
M15 N008 A Gnd Gnd NMOS
M16 N008 B Gnd Gnd NMOS
M17 N008 C Gnd Gnd NMOS
M18 N008 D Gnd Gnd NMOS
.ends 8i_or

.model NMOS NMOS
.model PMOS PMOS
.lib standard.mos
.backanno
.end